# Altium schematic sheet CODEC1.SchDoc: CODEC 1
size A3; Date: 2011-11-28; Author: S.Choquette; Revision: 2.0; SheetNumber: 7; SheetTotal: 9
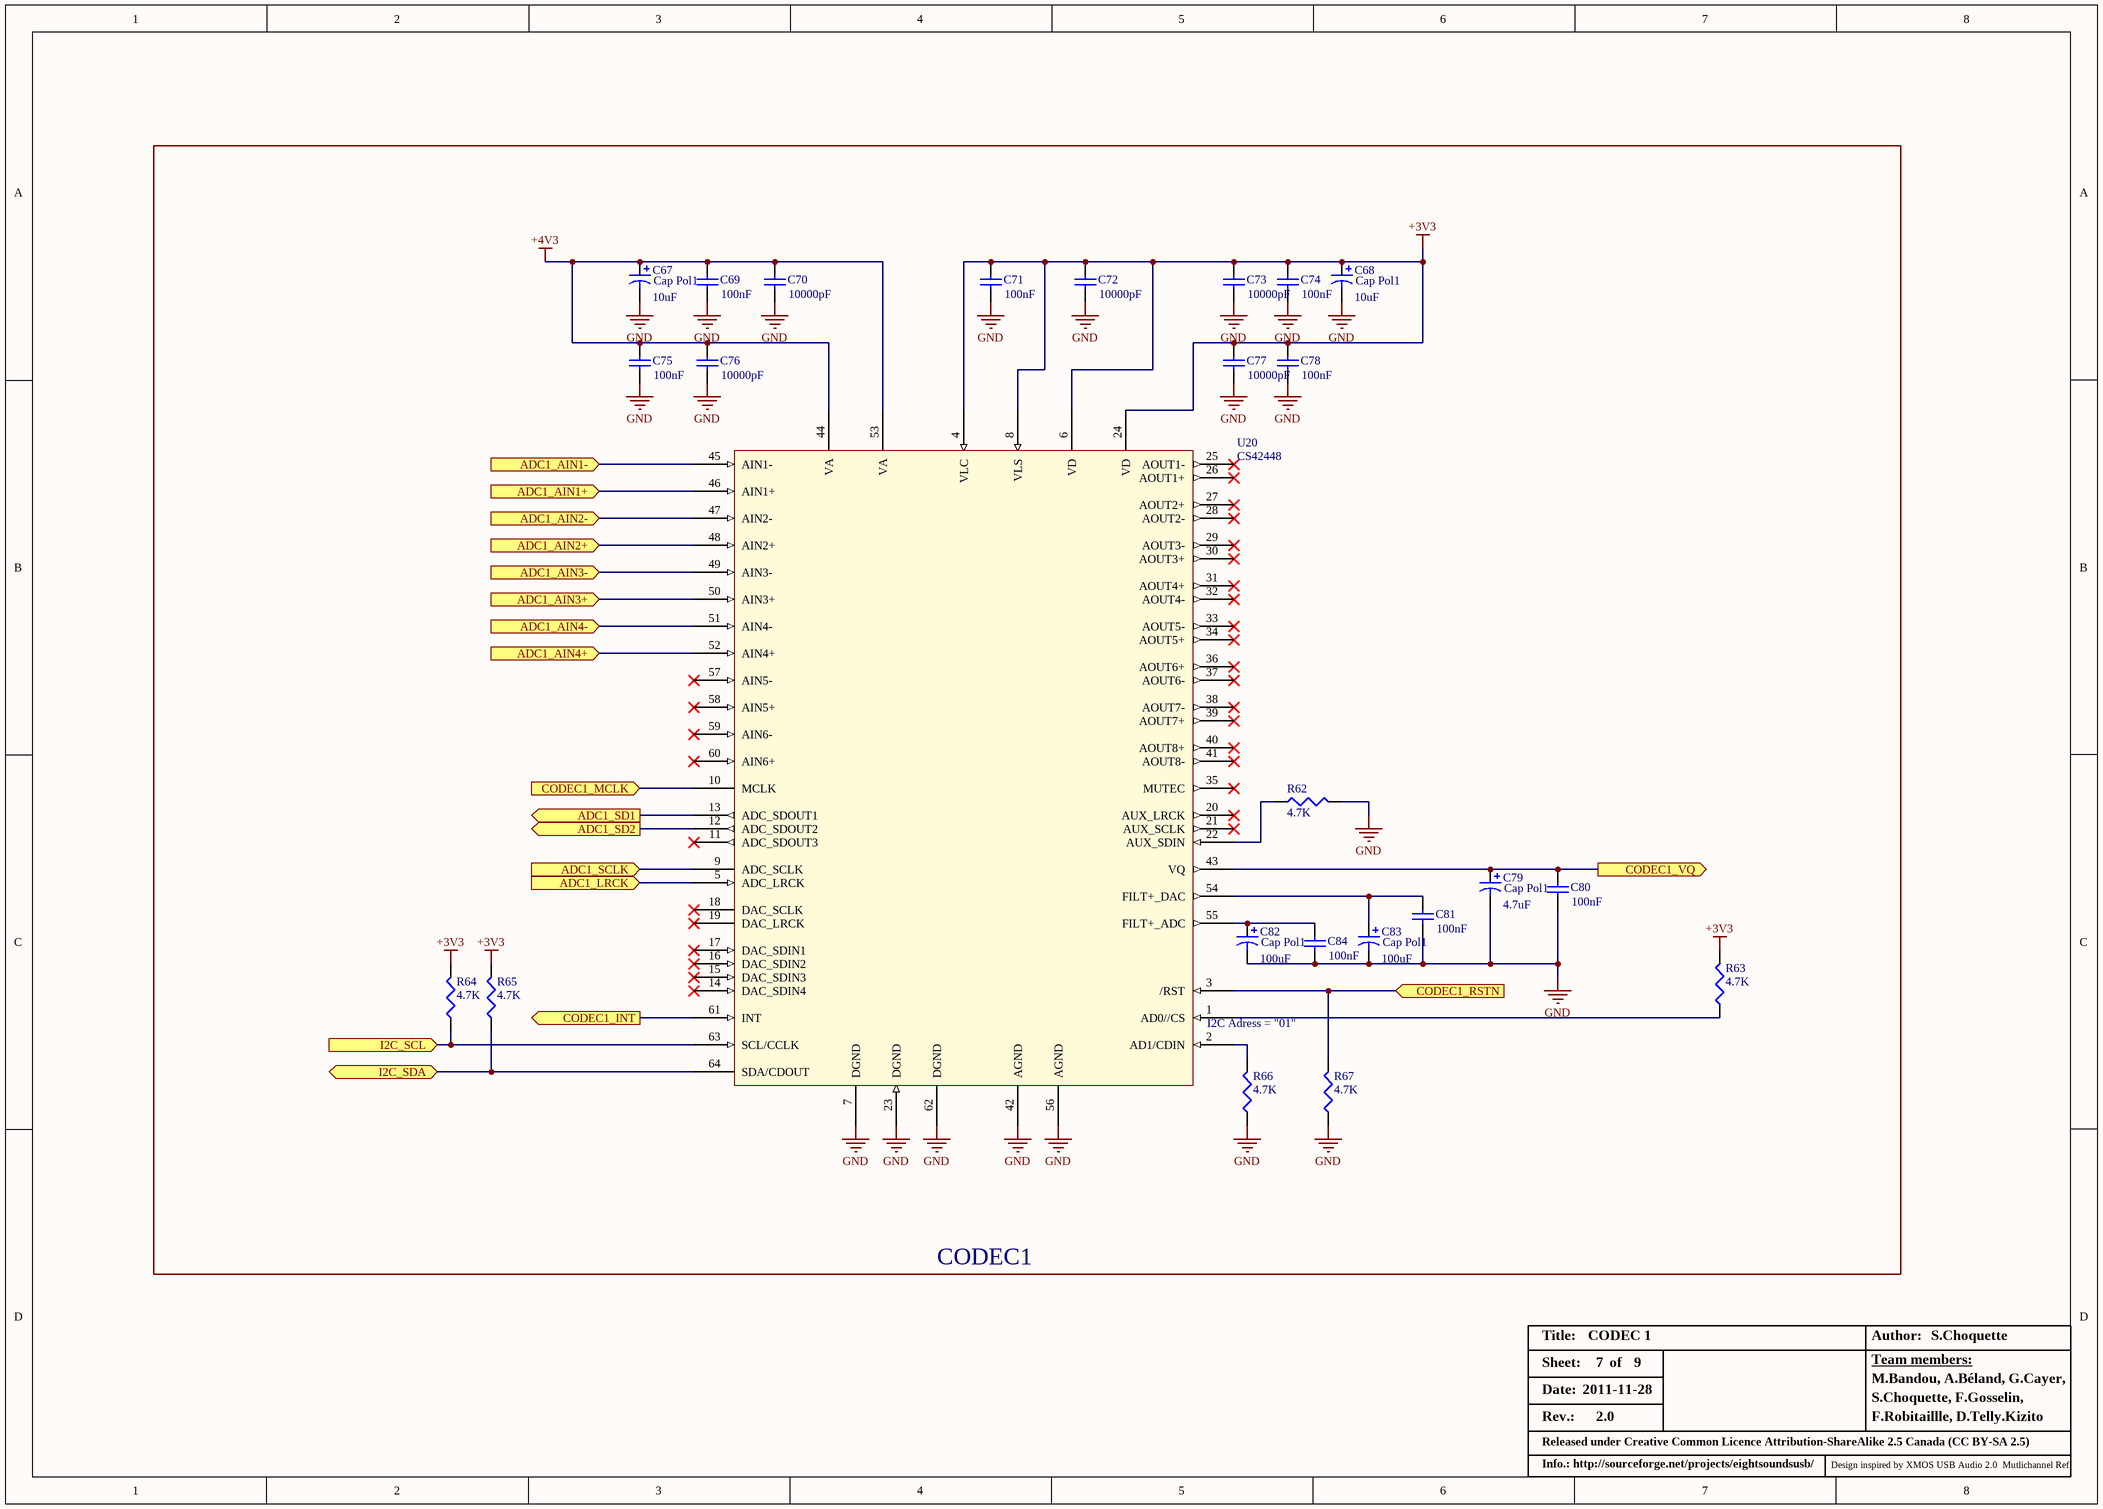
[diagram p0: CODEC1.SchDoc]

## Parts
C67  Cap Pol1  value 10uF  [AL_ELEC_SMD_B]
C68  Cap Pol1  value 10uF  [AL_ELEC_SMD_B]
C69  value 100nF  [2-0402]
C70  value 10000pF  [2-0402]
C71  value 100nF  [2-0402]
C72  value 10000pF  [2-0402]
C73  value 10000pF  [2-0402]
C74  value 100nF  [2-0402]
C75  value 100nF  [2-0402]
C76  value 10000pF  [2-0402]
C77  value 10000pF  [2-0402]
C78  value 100nF  [2-0402]
C79  Cap Pol1  value 4.7uF  [AL_ELEC_SMD_B]
C80  value 100nF  [2-0402]
C81  value 100nF  [2-0402]
C82  Cap Pol1  value 100uF  [AL_ELEC_SMD_D]
C83  Cap Pol1  value 100uF  [AL_ELEC_SMD_D]
C84  value 100nF  [2-0402]
R62  value 4.7K  [3-0603]
R63  value 4.7K  [3-0603]
R64  value 4.7K  [3-0603]
R65  value 4.7K  [3-0603]
R66  value 4.7K  [3-0603]
R67  value 4.7K  [3-0603]
U20  CS42448  [QFN50P1200X1200-64V1L-MOD]

## Ports
ADC1_AIN1+ (in), ADC1_AIN1- (in), ADC1_AIN2+ (in), ADC1_AIN2- (in), ADC1_AIN3+ (in), ADC1_AIN3- (in), ADC1_AIN4+ (in), ADC1_AIN4- (in), ADC1_LRCK (in), ADC1_SCLK (in), ADC1_SD1 (out), ADC1_SD2 (out), CODEC1_INT (out), CODEC1_MCLK (in), CODEC1_RSTN (in), CODEC1_VQ (out), I2C_SCL (in), I2C_SDA (bidir)

## Nets
+3V3: C68.1 C71.2 C72.2 C73.2 C74.2 C77.2 C78.2 R63.2 R64.2 R65.2 U20.4(VLC) U20.6(VD) U20.8(VLS) U20.24(VD)
+4V3: C67.1 C69.2 C70.2 C75.2 C76.2 U20.44(VA) U20.53(VA)
GND: C67.2 C68.2 C69.1 C70.1 C71.1 C72.1 C73.1 C74.1 C75.1 C76.1 C77.1 C78.1 C79.2 C80.1 C81.1 C82.2 C83.2 C84.1 R62.2 R66.1 R67.1 U20.7(DGND) U20.23(DGND) U20.42(AGND) U20.56(AGND) U20.62(DGND)
ADC1_AIN1+: U20.46(AIN1+) ; port ADC1_AIN1+
ADC1_AIN1-: U20.45(AIN1-) ; port ADC1_AIN1-
ADC1_AIN2+: U20.48(AIN2+) ; port ADC1_AIN2+
ADC1_AIN2-: U20.47(AIN2-) ; port ADC1_AIN2-
ADC1_AIN3+: U20.50(AIN3+) ; port ADC1_AIN3+
ADC1_AIN3-: U20.49(AIN3-) ; port ADC1_AIN3-
ADC1_AIN4+: U20.52(AIN4+) ; port ADC1_AIN4+
ADC1_AIN4-: U20.51(AIN4-) ; port ADC1_AIN4-
ADC1_LRCK: U20.5(ADC_LRCK) ; port ADC1_LRCK
ADC1_SCLK: U20.9(ADC_SCLK) ; port ADC1_SCLK
ADC1_SD1: U20.13(ADC_SDOUT1) ; port ADC1_SD1
ADC1_SD2: U20.12(ADC_SDOUT2) ; port ADC1_SD2
CODEC1_INT: U20.61(INT) ; port CODEC1_INT
CODEC1_MCLK: U20.10(MCLK) ; port CODEC1_MCLK
CODEC1_RSTN: R67.2 U20.3(/RST) ; port CODEC1_RSTN
CODEC1_VQ: C79.1 C80.2 U20.43(VQ) ; port CODEC1_VQ
I2C_SCL: R64.1 U20.63(SCL/CCLK) ; port I2C_SCL
I2C_SDA: R65.1 U20.64(SDA/CDOUT) ; port I2C_SDA
NetC81_2: C81.2 C83.1 U20.54(FILT+_DAC)
NetC82_1: C82.1 C84.2 U20.55(FILT+_ADC)
NetR62_1: R62.1 U20.22(AUX_SDIN)
NetR63_1: R63.1 U20.1(AD0//CS)
NetR66_2: R66.2 U20.2(AD1/CDIN)

Not connected (* = marked no-connect by the designer): U20 11(ADC_SDOUT3)* 14(DAC_SDIN4)* 15(DAC_SDIN3)* 16(DAC_SDIN2)* 17(DAC_SDIN1)* 18(DAC_SCLK)* 19(DAC_LRCK)* 20(AUX_LRCK)* 21(AUX_SCLK)* 25(AOUT1-)* 26(AOUT1+)* 27(AOUT2+)* 28(AOUT2-)* 29(AOUT3-)* 30(AOUT3+)* 31(AOUT4+)* 32(AOUT4-)* 33(AOUT5-)* 34(AOUT5+)* 35(MUTEC)* 36(AOUT6+)* 37(AOUT6-)* 38(AOUT7-)* 39(AOUT7+)* 40(AOUT8+)* 41(AOUT8-)* 57(AIN5-)* 58(AIN5+)* 59(AIN6-)* 60(AIN6+)*

## Notes on the sheet
- (near U20) I2C Adress = "01"
- CODEC1
- Title:
- Date:
- Sheet:
- of
- Author:
- Team members:
- M.Bandou, A.Béland, G.Cayer,
- Rev.:
- Released under Creative Common Licence Attribution-ShareAlike 2.5 Canada (CC BY-SA 2.5)
- S.Choquette, F.Gosselin,
- F.Robitaillle, D.Telly.Kizito
- Info.: http://sourceforge.net/projects/eightsoundsusb/
- Design inspired by XMOS USB Audio 2.0  Mutlichannel Ref.

## Library data of the parts
C67 C68 = Cap Pol1: Al Elec 10uF CaseB 16V; Manufacturer: Panasonic; Part Number: EEEFK1C100R; Cost: *
C69 C71 C74 C75 C78 C80 C81 C84 = Cap: MLCC 100nF 0402 X7R 16V; Manufacturer: Murata; Part Number: GRM155R71C104KA88; Cost: 0,005
C70 C72 C73 C76 C77 = Cap: MLCC 10000pF 0402 X7R 25V; Manufacturer: Murata; Part Number: GRM155R71E103KA01D; Cost: 0,005
C79 = Cap Pol1: Al Elec 4.7uF CaseB 35V; Manufacturer: Panasonic; Part Number: EEEFK1V4R7R; Cost: *
C82 C83 = Cap Pol1: Al Elec 100uF CaseD 16V; Manufacturer: Panasonic; Part Number: EEEFK1C101P; Cost: *
R62-R67 = Res3: RES 4.7k 0603 1%; Manufacturer: ROHM; Part Number: MCR03EZPFX4701; Cost: *
U20 = CS42448: 108 dB, 192 kHz 6-in, 8-out Multi-Channel Codec; Manufacturer: Cirrus Logic; Part Number: CS42448